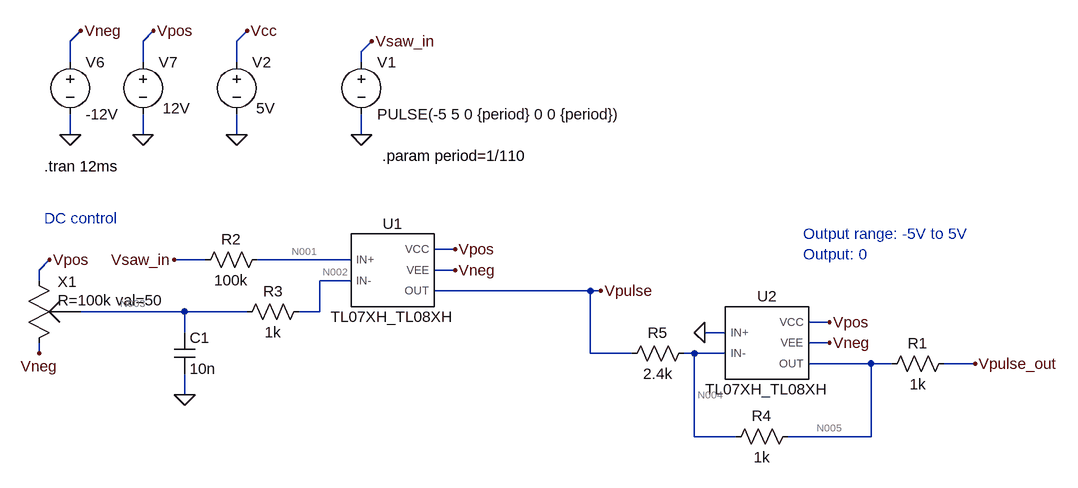
[diagram p0: schematic main_SAW_to_PULSE_PWM_SQUARE.asc]
main_SAW_to_PULSE_PWM_SQUARE.asc, the LTspice schematic file:
Version 4
SHEET 1 3072 1764
WIRE -368 -1216 -352 -1232
WIRE -256 -1216 -240 -1232
WIRE -112 -1216 -96 -1232
WIRE 80 -1200 96 -1216
WIRE -368 -1184 -368 -1216
WIRE -256 -1184 -256 -1216
WIRE -112 -1184 -112 -1216
WIRE 80 -1184 80 -1200
WIRE -368 -1072 -368 -1104
WIRE -256 -1072 -256 -1104
WIRE -112 -1072 -112 -1104
WIRE 80 -1072 80 -1104
WIRE 224 -896 192 -896
WIRE -160 -880 -208 -880
WIRE 64 -880 -80 -880
WIRE -416 -864 -400 -880
WIRE 224 -864 192 -864
WIRE -416 -848 -416 -864
WIRE 64 -848 16 -848
WIRE 432 -832 192 -832
WIRE 448 -832 432 -832
WIRE -192 -800 -352 -800
WIRE -96 -800 -192 -800
WIRE 16 -800 16 -848
WIRE 16 -800 -16 -800
WIRE 800 -784 768 -784
WIRE -192 -768 -192 -800
WIRE 640 -768 608 -768
WIRE 800 -752 768 -752
WIRE -416 -736 -416 -752
WIRE 432 -736 432 -832
WIRE 496 -736 432 -736
WIRE 592 -736 576 -736
WIRE 640 -736 592 -736
WIRE 864 -720 768 -720
WIRE 896 -720 864 -720
WIRE 1024 -720 976 -720
WIRE -192 -672 -192 -704
WIRE 592 -608 592 -736
WIRE 656 -608 592 -608
WIRE 864 -608 864 -720
WIRE 864 -608 736 -608
FLAG -368 -1072 0
FLAG -256 -1072 0
FLAG -352 -1232 Vneg
FLAG -240 -1232 Vpos
FLAG -208 -880 Vsaw_in
FLAG 448 -832 Vpulse
FLAG 80 -1072 0
FLAG 96 -1216 Vsaw_in
FLAG -112 -1072 0
FLAG -96 -1232 Vcc
FLAG 224 -864 Vneg
FLAG 224 -896 Vpos
FLAG -400 -880 Vpos
FLAG -416 -736 Vneg
FLAG 1024 -720 Vpulse_out
FLAG 800 -752 Vneg
FLAG 800 -784 Vpos
FLAG 608 -768 0
FLAG -192 -672 0
SYMBOL voltage -368 -1200 R0
WINDOW 123 0 0 Left 0
WINDOW 39 0 0 Left 0
SYMATTR InstName V6
SYMATTR Value -12V
SYMBOL voltage -256 -1200 R0
WINDOW 123 0 0 Left 0
WINDOW 39 0 0 Left 0
WINDOW 3 30 87 Left 2
SYMATTR Value 12V
SYMATTR InstName V7
SYMBOL TL07XH_TL08XH 128 -864 R0
SYMATTR InstName U1
SYMBOL voltage 80 -1200 R0
WINDOW 123 0 0 Left 0
WINDOW 39 0 0 Left 0
SYMATTR InstName V1
SYMATTR Value PULSE(-5 5 0 {period} 0 0 {period})
SYMBOL res -64 -896 R90
WINDOW 0 0 56 VBottom 2
WINDOW 3 32 56 VTop 2
SYMATTR InstName R2
SYMATTR Value 100k
SYMBOL voltage -112 -1200 R0
WINDOW 123 0 0 Left 0
WINDOW 39 0 0 Left 0
WINDOW 3 30 87 Left 2
SYMATTR Value 5V
SYMATTR InstName V2
SYMBOL pot -432 -864 R0
WINDOW 0 45 18 Left 2
WINDOW 39 45 46 Left 2
SYMATTR InstName X1
SYMATTR SpiceLine R=100k val=50
SYMBOL TL07XH_TL08XH 704 -752 R0
SYMATTR InstName U2
SYMBOL res 992 -736 R90
WINDOW 0 0 56 VBottom 2
WINDOW 3 32 56 VTop 2
SYMATTR InstName R1
SYMATTR Value 1k
SYMBOL res 752 -624 R90
WINDOW 0 0 56 VBottom 2
WINDOW 3 32 56 VTop 2
SYMATTR InstName R4
SYMATTR Value 1k
SYMBOL res 592 -752 R90
WINDOW 0 0 56 VBottom 2
WINDOW 3 32 56 VTop 2
SYMATTR InstName R5
SYMATTR Value 2.4k
SYMBOL res 0 -816 R90
WINDOW 0 0 56 VBottom 2
WINDOW 3 32 56 VTop 2
SYMATTR InstName R3
SYMATTR Value 1k
SYMBOL cap -208 -768 R0
SYMATTR InstName C1
SYMATTR Value 10n
TEXT -408 -1024 Left 2 !.tran 12ms
TEXT 112 -1040 Left 2 !.param period=1/110
TEXT -408 -944 Left 2 ;DC control
TEXT 760 -920 Left 2 ;Output range: -5V to 5V\nOutput: 0

The netlist it stands for:
* main_SAW_to_PULSE_PWM_SQUARE.asc
V6 Vneg 0 -12V
V7 Vpos 0 12V
XU1 N001 N002 Vpos Vneg Vpulse TL07XH_TL08XH  ; pins IN+ IN- VCC VEE OUT
V1 Vsaw_in 0 PULSE(-5 5 0 {period} 0 0 {period})
R2 N001 Vsaw_in 100k
V2 Vcc 0 5V
XX1 Vpos Vneg N003 pot R=100k val=50  ; pins 1 3 2
XU2 0 N004 Vpos Vneg N005 TL07XH_TL08XH  ; pins IN+ IN- VCC VEE OUT
R1 Vpulse_out N005 1k
R4 N005 N004 1k
R5 N004 Vpulse 2.4k
R3 N002 N003 1k
C1 N003 0 10n
.tran 12ms
.param period=1/110
* DC control
* Output range: -5V to 5V
* Output: 0
.lib C:\HOME_projects\SYNTH_GOOM\2LineartoExponential\tl07xh_tl08xh.lib
.backanno
.end

* Results of the author's LTspice run, read from the files saved beside the schematic
* Operating Point, zero values left out:
*   V(vneg) = -12 V
*   V(vpos) = 12 V
*   V(vpulse) = -11.72 V
*   V(n002) = -13.01 nV
*   V(n001) = -5 V
*   V(vsaw_in) = -5 V
*   V(vcc) = 5 V
*   V(n003) = -12.51 nV
*   V(n005) = 4.878 V
*   V(n004) = -4.429 mV
*   V(vpulse_out) = 4.878 V
*   I(R5) = 4.883 mA
*   I(R4) = 4.883 mA
*   I(R2) = 23.77 pA
*   I(V1) = 23.77 pA
*   I(V7) = -6.998 mA
*   I(V6) = 6.998 mA
*   Ix(u1:IN+) = -23.71 pA
*   Ix(u1:VCC) = 937.5 µA
*   Ix(u1:VEE) = -5.82 mA
*   Ix(u1:OUT) = 4.883 mA
*   Ix(x1:1) = 240 µA
*   Ix(x1:3) = -240 µA
*   Ix(u2:VCC) = 5.82 mA
*   Ix(u2:VEE) = -937.5 µA
*   Ix(u2:OUT) = -4.883 mA
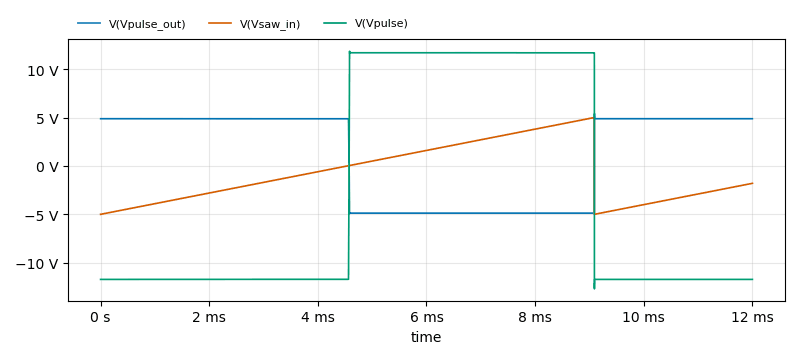
[diagram p1: Transient Analysis of main_SAW_to_PULSE_PWM_SQUARE.asc, plotted from the saved traces]
* Transient Analysis, 1 run:
*   V(Vpulse_out): min -4.933 V, max 5.415 V, average 1.206 V, rms 4.876 V, last 4.878 V
*   V(Vsaw_in): min -5 V, max 5 V, average -824.4 mV, rms 3.179 V, last -1.798 V
*   V(Vpulse): min -12.7 V, max 11.85 V, average -2.91 V, rms 11.71 V, last -11.72 V